# Altium schematic sheet STM32_H750_IO2.SchDoc
size A4; SheetNumber: 3; SheetTotal: 3
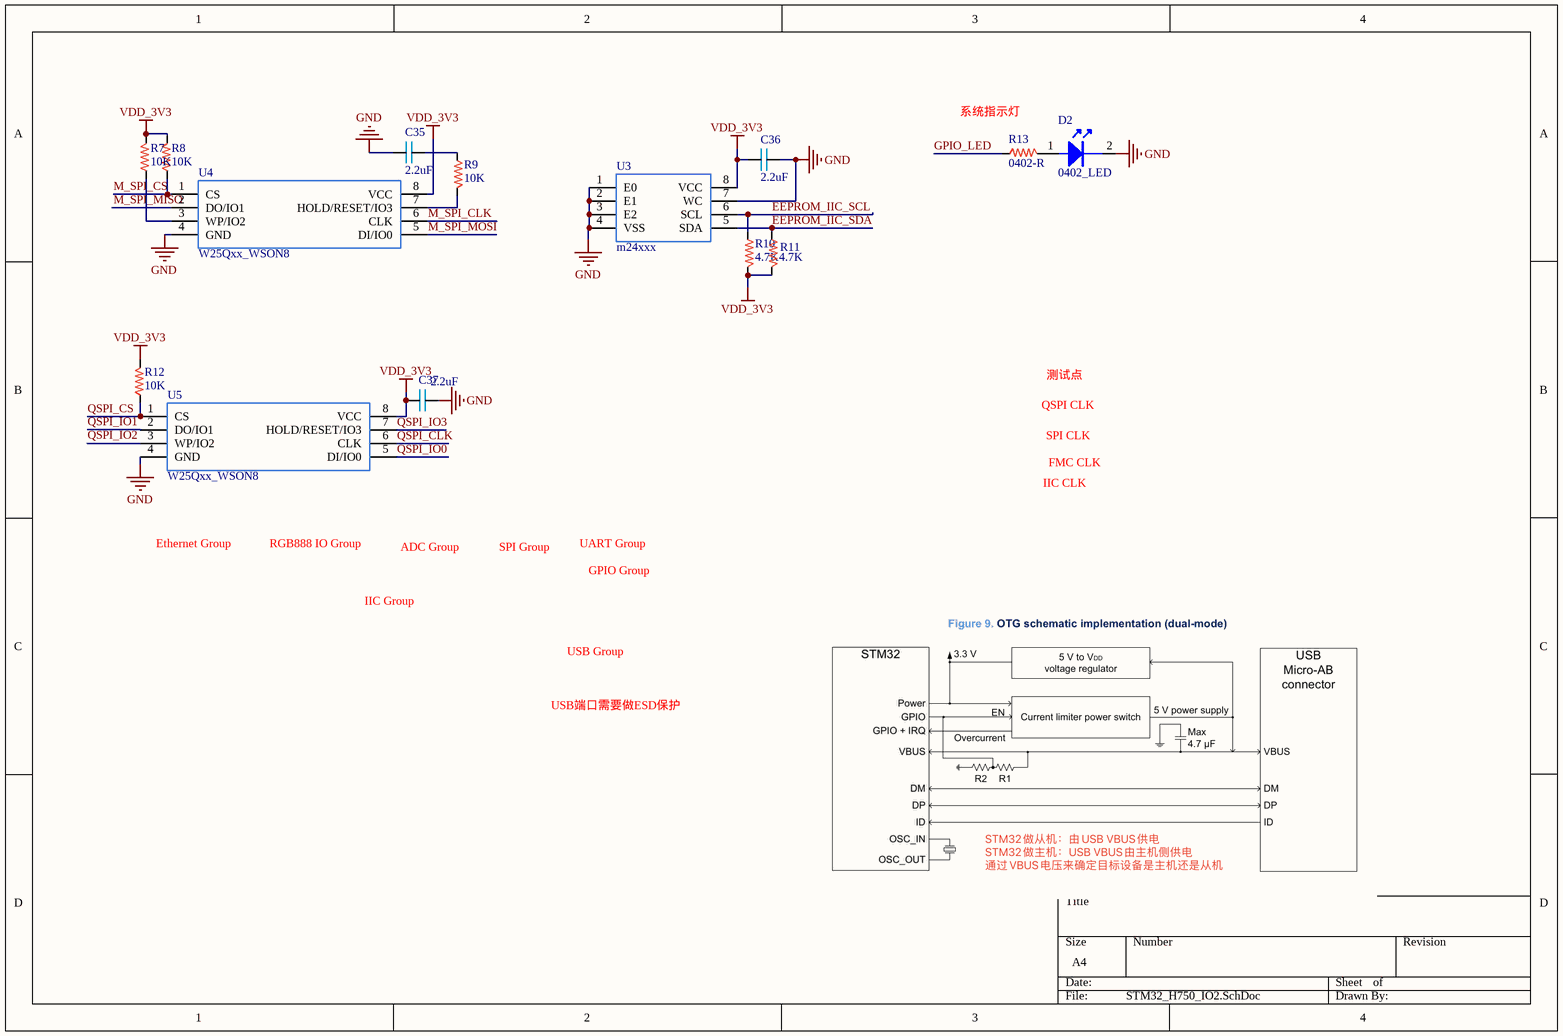
[diagram p0: STM32_H750_IO2.SchDoc]

## Parts
C35  2.2uF  [0603P - 2]
C36  2.2uF  [0603P - 2]
C37  2.2uF  [0603P - 2]
D2  0402_LED  [0402 - LED]
R7  10K  [0402]
R8  10K  [0402]
R9  10K  [0402]
R10  4.7K  [0402]
R11  4.7K  [0402]
R12  10K  [0402]
R13  0402-R  [0402]
U3  m24xxx  [DFN-8]
U4  W25Qxx_WSON8  [WSON-8]
U5  W25Qxx_WSON8  [WSON-8]

## Nets
GND: C35.2 C36.2 C37.2 D2.2 U3.1(E0) U3.2(E1) U3.3(E2) U3.4(VSS) U3.7(WC) U4.4(GND) U5.4(GND)
VDD_3V3: C36.1 C37.1 R7.2 R8.2 R10.2 R11.2 R12.2 U3.8(VCC) U4.8(VCC) U5.8(VCC)
EEPROM_IIC_SCL: R10.1 U3.6(SCL)
EEPROM_IIC_SDA: R11.1 U3.5(SDA)
GPIO_LED: R13.1
M_SPI_CLK: U4.6(CLK)
M_SPI_CS: R8.1 U4.1(CS)
M_SPI_MISO: U4.2(DO/IO1)
M_SPI_MOSI: U4.5(DI/IO0)
QSPI_CLK: U5.6(CLK)
QSPI_CS: R12.1 U5.1(CS)
QSPI_IO0: U5.5(DI/IO0)
QSPI_IO1: U5.2(DO/IO1)
QSPI_IO2: U5.3(WP/IO2)
QSPI_IO3: U5.7(HOLD/RESET/IO3)
NetC35_1: C35.1 R9.1
NetD2_1: D2.1 R13.2
NetR7_1: R7.1 U4.3(WP/IO2)
NetR9_2: R9.2 U4.7(HOLD/RESET/IO3)

## Notes on the sheet
- (near R13) 系统指示灯
- 测试点
- QSPI CLK
- SPI CLK
- FMC CLK
- IIC CLK
- Ethernet Group
- RGB888 IO Group
- ADC Group
- SPI Group
- UART Group
- GPIO Group
- IIC Group
- USB Group
- USB端口需要做ESD保护

## Library data of the parts
C35-C37 = 0603-C_Min
R7-R12 = 0402-R
U3 = m24xxx: ST EEPROM